# EAGLE design swamp-cooler (EAGLE 7.5.0)
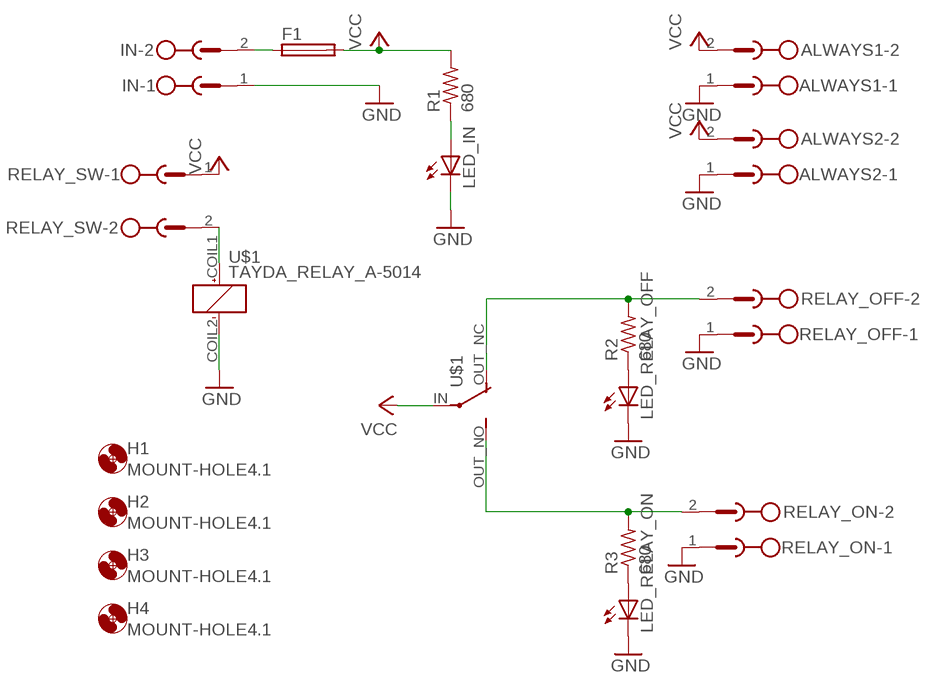
[diagram p0: schematic, sheet 1]

## Parts
ALWAYS1  MSTBV2  [MSTBV2]
ALWAYS2  MSTBV2  [MSTBV2]
F1  SH22,5A  [SH22,5A]
H1  MOUNT-HOLE4.1  [4,1]
H2  MOUNT-HOLE4.1  [4,1]
H3  MOUNT-HOLE4.1  [4,1]
H4  MOUNT-HOLE4.1  [4,1]
IN  MSTBV2  [MSTBV2]
LED_IN  LED5MM  [LED5MM]
LED_RELAY_OFF  LED5MM  [LED5MM]
LED_RELAY_ON  LED5MM  [LED5MM]
R1  680  R-US_0204/7  [0204/7]
R2  680  R-US_0204/7  [0204/7]
R3  680  R-US_0204/7  [0204/7]
RELAY_OFF  MSTBV2  [MSTBV2]
RELAY_ON  MSTBV2  [MSTBV2]
RELAY_SW  MSTBV2  [MSTBV2]
U$1  TAYDA_RELAY_A-5014  [TAYDA_RELAY_A-5014]

## Nets
GND: ALWAYS1.1 ALWAYS2.1 IN.1 LED_IN.K(C) LED_RELAY_OFF.K(C) LED_RELAY_ON.K(C) RELAY_OFF.1 RELAY_ON.1 U$1.COIL2(-)
N$1: LED_IN.A R1.1
N$2: LED_RELAY_OFF.A R2.1
N$3: R2.2 RELAY_OFF.2 U$1.OUT_NC(NC)
N$4: LED_RELAY_ON.A R3.1
N$5: R3.2 RELAY_ON.2 U$1.OUT_NO(NO)
N$6: F1.1 IN.2
N$7: RELAY_SW.2 U$1.COIL1(+)
VCC: ALWAYS1.2 ALWAYS2.2 F1.2 R1.2 RELAY_SW.1 U$1.IN

## Library data of the parts
ALWAYS1 ALWAYS2 IN RELAY_OFF RELAY_ON RELAY_SW = con-phoenix-500:MSTBV2: PHOENIX; OC_FARNELL: unknown; OC_NEWARK: unknown
F1 = fuse:SH22,5A: FUSE HOLDER grid 22,5mm, isolated cap OGN0031 8201, Schurter (Buerklin); MPN: 0031.7701.11; OC_FARNELL: unknown; OC_NEWARK: 04F1224
H1-H4 = holes:MOUNT-HOLE: MOUNTING HOLE with drill center marker
LED_IN LED_RELAY_OFF LED_RELAY_ON = led:LED: LED OSRAM: - CHIPLED LG R971, LG N971, LY N971, LG Q971, LY Q971, LO R971, LY R971 LH N974, LH R974 LS Q976, LO Q976, LY Q976 LO Q996 - Hyper CHIPLED LW Q18S LB Q993, LB Q99A, LB R99A - SideLED LS A670, LO A670, LY A670, LG A670, LP A670 LB A673, LV A673, LT A673, LW A673 LH A674 LY A675 LS A676, LA A676, LO A676, LY A676, LW A676 LS A679, LY A679, LG A679 - Hyper Micro SIDELED® LS Y876, LA Y876, LO Y876, LY Y876 LT Y87S - SmartLED LW L88C, LW L88S LB L89C, LB L89S, LG L890 LS L89K, LO L89K, LY L89K LS L896, LA L896, LO L896, LY L896 - TOPLED LS T670, LO T670, LY T670, LG T670, LP T670 LSG T670, LSP T670, LSY T670, LOP T670, LYG T670 LG T671, LOG T671, LSG T671 LB T673, LV T673, LT T673, LW T673 LH T674 LS T676, LA T676, LO T676, LY T676, LB T676, LH T676, LSB T676, LW T676 LB T67C, LV T67C, LT T67C, LS T67K, LO T67K, LY T67K, LW E67C LS E67B, LA E67B, LO E67B, LY E67B, LB E67C, LV E67C, LT E67C LW T67C LS T679, LY T679, LG T679 LS T770, LO T770, LY T770, LG T770, LP T770 LB T773, LV T773, LT T773, LW T773 LH T774 LS E675, LA E675, LY E675, LS T675 LS T776, LA T776, LO T776, LY T776, LB T776 LHGB T686 LT T68C, LB T68C - Hyper Mini TOPLED® LB M676 - Mini TOPLED Santana® LG M470 LS M47K, LO M47K, LY M47K Source: http://www.osram.convergy.de LUXEON: - LUMILED® LXK2-PW12-R00, LXK2-PW12-S00, LXK2-PW14-U00, LXK2-PW14-V00 LXK2-PM12-R00, LXK2-PM12-S00, LXK2-PM14-U00 LXK2-PE12-Q00, LXK2-PE12-R00, LXK2-PE12-S00, LXK2-PE14-T00, LXK2-PE14-U00 LXK2-PB12-K00, LXK2-PB12-L00, LXK2-PB12-M00, LXK2-PB14-N00, LXK2-PB14-P00, LXK2-PB14-Q00 LXK2-PR12-L00, LXK2-PR12-M00, LXK2-PR14-Q00, LXK2-PR14-R00 LXK2-PD12-Q00, LXK2-PD12-R00, LXK2-PD12-S00 LXK2-PH12-R00, LXK2-PH12-S00 LXK2-PL12-P00, LXK2-PL12-Q00, LXK2-PL12-R00 Source: www.luxeon.com KINGBRIGHT: KA-3528ASYC Source: www.kingbright.com
R1-R3 = rcl:R-US_: RESISTOR, American symbol
U$1 = tayda:TAYDA_RELAY_A-5014

## Board
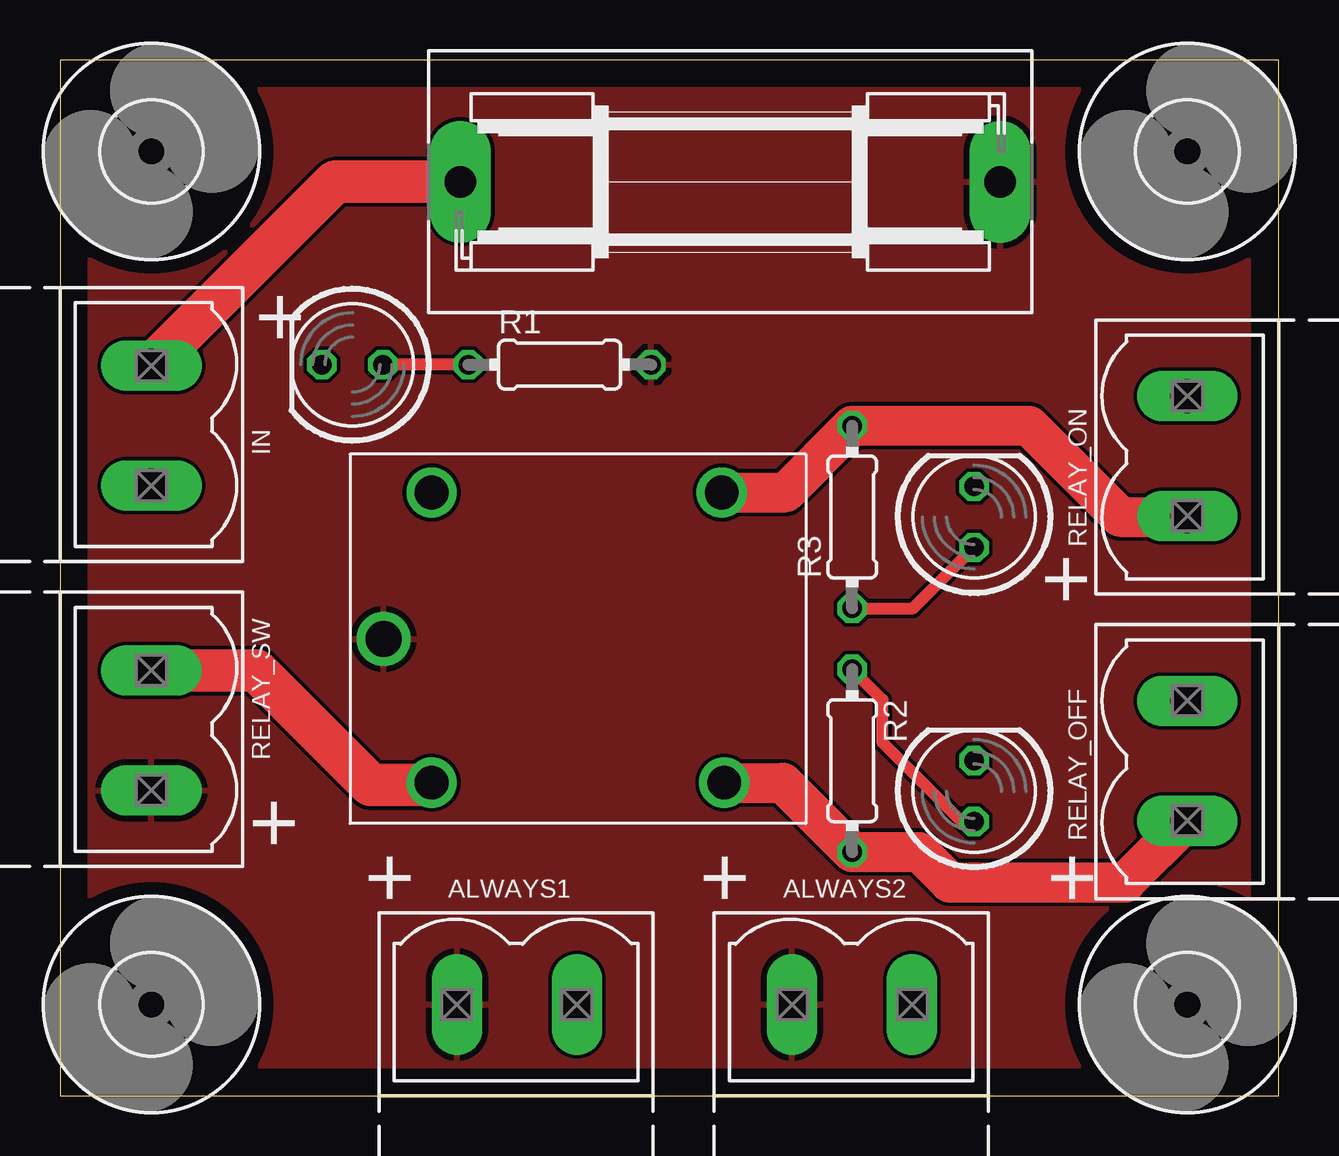
[diagram p1: board, top side]
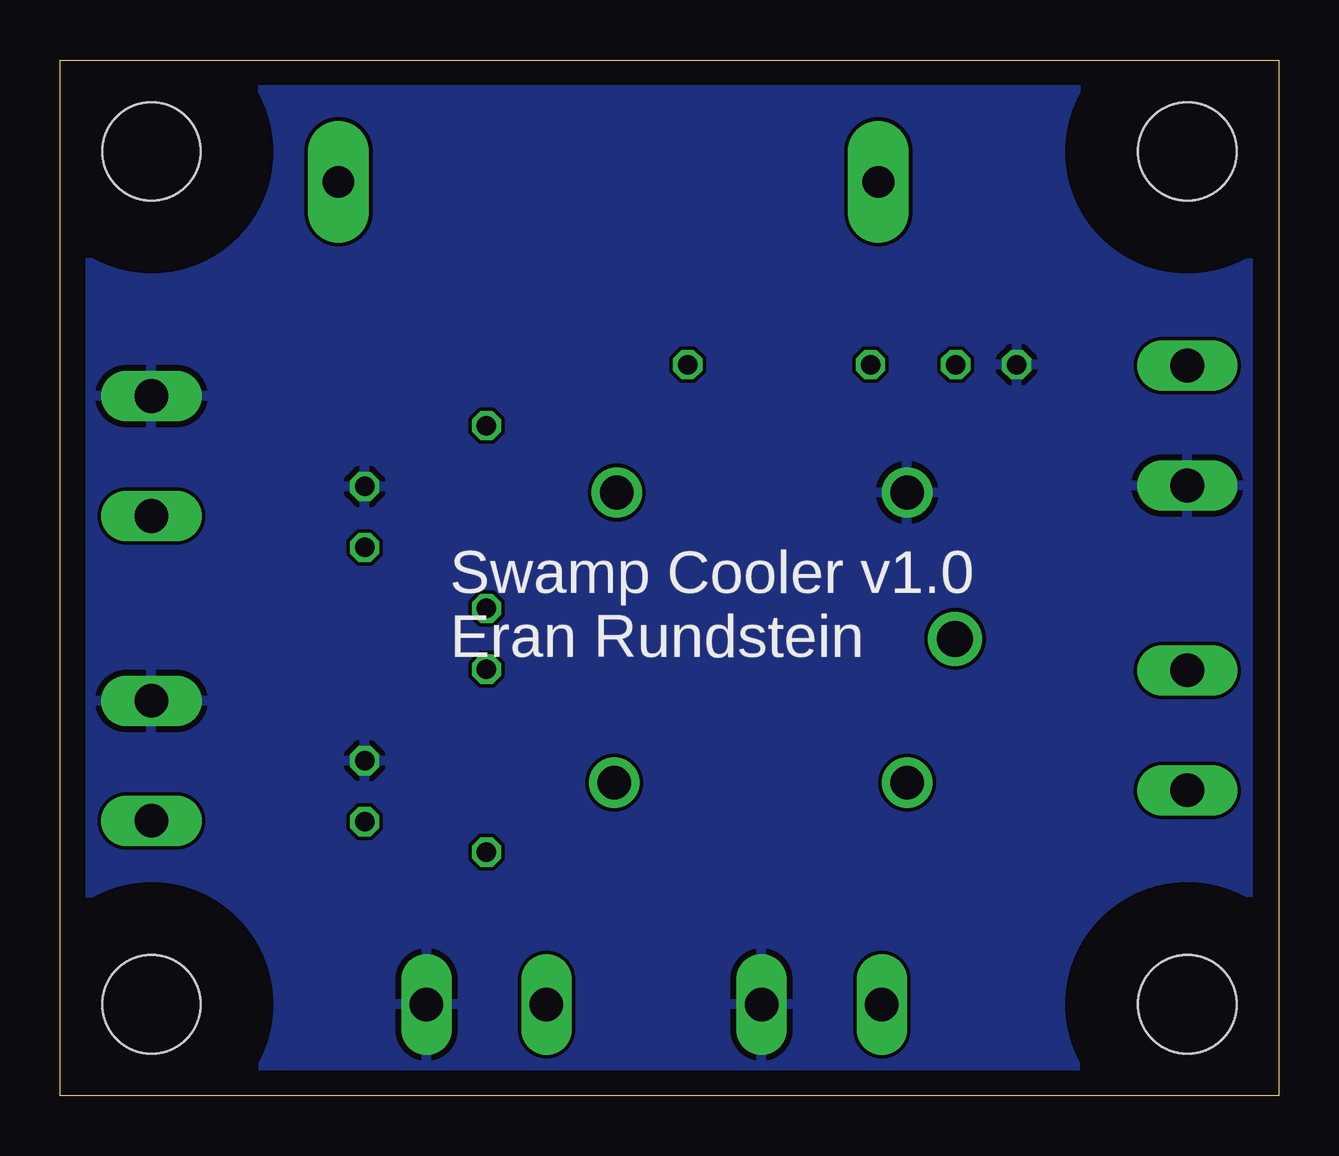
[diagram p2: board, bottom side, seen from below]

Size 50.8 x 43.18 mm. Coordinates in mm from the lower left corner, seen from the top.
Outline: 0,0 50.8,0 50.8,43.18 0,43.18 0,0
Copper layers (1*16): Top 0.0356mm / dielectric 1.5011mm / Bottom 0.0356mm
Design rules "oshpark": minimum track width 6mil, minimum drill 13mil, track to track 6mil, track to pad 6mil, pad to pad 6mil, via to via 6mil, smd to smd 6mil, copper to edge 15mil, drill to drill 6mil, minimum pad ring 7mil, minimum via ring 7mil, stop-mask expansion 3mil, vias tented up to drill 0mil, thermal gap 10mil

### Footprints (pad centres in the part's own frame; a part is rotated, then mirrored left to right if it is on the bottom)
MSTBV2 = drill 1.397 long: 1 -2.5,0; 2 2.5,0
SH22,5A = drill 1.321 pad 2.54 long: 1 -11.252,0; 2 11.252,0
4,1 = hole 4.1: 0,0
LED5MM = drill 0.813 octagon: A -1.27,0; K 1.27,0
0204/7 = drill 0.813 octagon: 1 -3.81,0; 2 3.81,0
TAYDA_RELAY_A-5014 = drill 1.4: COIL1 6.1,6; COIL2 6.1,-6.1; OUT_NC -6.1,6; OUT_NO -6,-6.1 | drill 1.5: IN 8.1,0

### Placement (x,y rotation side)
ALWAYS1  19.05,3.81 180 top
ALWAYS2  33.02,3.81 180 top
F1  27.94,38.1 0 top
H1  3.81,3.81 0 top
H2  46.99,3.81 0 top
H3  3.81,39.37 0 top
H4  46.99,39.37 0 top
IN  3.81,27.94 90 top
LED_IN  12.19,30.48 180 top
LED_RELAY_OFF  38.1,12.7 90 top
LED_RELAY_ON  38.1,24.13 90 top
R1  20.83,30.48 0 top
R2  33.02,13.97 270 top
R3  33.02,24.13 90 top
RELAY_OFF  46.99,13.97 270 top
RELAY_ON  46.99,26.67 270 top
RELAY_SW  3.81,15.24 90 top
U$1  21.59,19.05 180 top

### Tracks (layer width: path | path; a pad name or v marks a point on that pad's centre or on a via)
GND
  pour Bottom: 1.27,41.91 49.53,41.91 49.53,1.27 1.27,1.27
N$1
  Top 0.508: R1.1 LED_IN.A
N$2
  Top 0.508: LED_RELAY_OFF.A 37.59,11.43 34.29,14.73 34.29,16.51 R2.1
N$3
  Top 1.676: U$1.OUT_NC 30.13,13.05 R2.2 35.81,10.16 37.08,8.89 | 37.08,8.89 44.41,8.89 | 44.41,8.89 RELAY_OFF.2 | 37.08,8.89 44.41,8.89
N$4
  Top 0.508: R3.1 35.56,20.32 LED_RELAY_ON.A
N$5
  Top 1.676: U$1.OUT_NO 30.23,25.15 R3.2 40.39,27.94 44.2,24.13 46.95,24.13 RELAY_ON.2
N$6
  Top 1.778: F1.1 11.47,38.1 IN.2
N$7
  Top 1.778: RELAY_SW.2 8.17,17.74 12.95,12.95 15.39,12.95 U$1.COIL1
VCC
  pour Top: 1.52,1.27 49.53,1.27 49.53,41.91 1.27,41.91 1.27,1.27

### Text on the board
tPlace: + | + | + | + | + | +
bPlace: Swamp Cooler v1.0 / Eran Rundstein